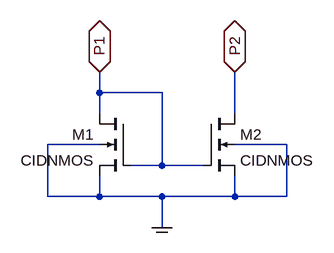
[diagram p0: schematic cmirror.asc]
cmirror.asc, the LTspice schematic file:
Version 4.1
SHEET 1 880 680
WIRE 80 96 80 64
WIRE 176 96 80 96
WIRE 80 128 80 96
WIRE 288 128 288 64
WIRE 80 176 0 176
WIRE 368 176 288 176
WIRE 176 208 176 96
WIRE 176 208 128 208
WIRE 240 208 176 208
WIRE 0 256 0 176
WIRE 80 256 80 224
WIRE 80 256 0 256
WIRE 176 256 80 256
WIRE 288 256 288 224
WIRE 288 256 176 256
WIRE 368 256 368 176
WIRE 368 256 288 256
WIRE 176 304 176 256
FLAG 80 64 P1
IOPIN 80 64 BiDir
FLAG 288 64 P2
IOPIN 288 64 BiDir
FLAG 176 304 COM
IOPIN 176 304 BiDir
SYMBOL nmos4 128 128 M0
SYMATTR InstName M1
SYMATTR Value CIDNMOS
SYMATTR Value2 l=10u w=100u
SYMBOL nmos4 240 128 R0
SYMATTR InstName M2
SYMATTR Value CIDNMOS
SYMATTR Value2 l=10u w=100u

The netlist it stands for:
* cmirror.asc
M1 P1 P1 COM COM CIDNMOS l=10u w=100u
M2 P2 P1 COM COM CIDNMOS l=10u w=100u
.model NMOS NMOS
.model PMOS PMOS
.lib standard.mos
.backanno
.end